# Altium schematic sheet power_REG104GA_1V8.SchDoc
size A4
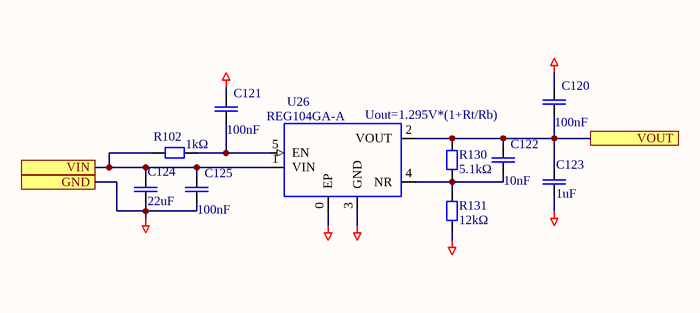
[diagram p0: power_REG104GA_1V8.SchDoc]

## Parts
C120  100nF  [CAPC1608N]
C121  100nF  [CAPC1608N]
C122  10nF  [CAPC1608N]
C123  1uF  [CAPC2012N]
C124  22uF  [CAPC2012N]
C125  100nF  [CAPC1608N]
R102  1kΩ  [RESC2012N]
R130  5.1kΩ  [RESC2012N]
R131  12kΩ  [RESC2012N]
U26  REG104GA-A  [SOT223]

## Ports
GND, VIN, VOUT

## Nets
GND: C120.2 C121.2 C123.1 C124.1 C125.1 R131.1 U26.0(EP) U26.3(GND) ; port GND
VIN: C124.2 C125.2 R102.2 U26.1(VIN) ; port VIN
VOUT: C120.1 C122.2 C123.2 R130.2 U26.2(VOUT) ; port VOUT
NetC121_1: C121.1 R102.1 U26.5(EN)
NetC122_1: C122.1 R130.1 R131.2 U26.4(NR)

## Notes on the sheet
- (near U26) Uout=1.295V*(1+Rt/Rb)

## Library data of the parts
C120-C122 C125 = CAPC: Generic ceramic SMD capacitor; Pkg: 0603; Maintainer: Evgeniy Kotov; SMD Solders: 2; THD Solders: 0; Last Change Data: 06.03.2017; Release Date: 06.03.2017
  C120 C121 C125: PartField: 100nF; Value: 100nF
  C122: PartField: 10nF; Value: 10nF
C123 C124 = CAPC: Generic ceramic SMD capacitor; Pkg: 0805; Maintainer: Evgeniy Kotov; SMD Solders: 2; THD Solders: 0; Voltage Rating: 10V; Last Change Data: 06.03.2017; Release Date: 06.03.2017
  C123: PartField: 1uF; Value: 1uF
  C124: PartField: 22uF; Value: 22uF
R102 = RESC: Resistor, Generic, SMD; PartField: 150Ω; Pkg: 0805; Maintainer: Evgeniy Kotov; SMD Solders: 2; THD Solders: 0; Release Date: 06.03.2017; Last Change Data: 09.03.2017; Value: 1kΩ
R130 R131 = RESC: Resistor, Generic, SMD; Pkg: 0805; Maintainer: Evgeniy Kotov; SMD Solders: 2; THD Solders: 0; Release Date: 06.03.2017; Last Change Data: 09.03.2017
  R130: PartField: 5.1kΩ; Value: 5.1kΩ
  R131: PartField: 12kΩ; Value: 12kΩ
U26 = REG104GA-A: Single Output LDO, 1.0A, Adj.(1.295 to 5.5V), Low Noise, Fast Transient Response; Manufacturer: Texas Instruments; Manufacturer_Part_Number: reg104-a_dcq_6; INDUSTRY_STD_PKG_TYPE: SOT-223; FAMILY_NAME: SINGLE CHANNEL LDO; PIN_COUNT: 6; PACKAGE_DESIGNATOR: DCQ; Pkg: SOT-5EP; THD Solders: 0; Value: REG104GA-A; Datasheet URL: http://www.ti.com/lit/gpn/REG104-A; GENERIC_PART_NUMBER: REG104GA-A; Vendor: Texas Instruments; SMD Solders: 6; PartField: REG104GA-A